# EAGLE design SBC_6522_ISA_YM2612_v1 (EAGLE 9.6.2)
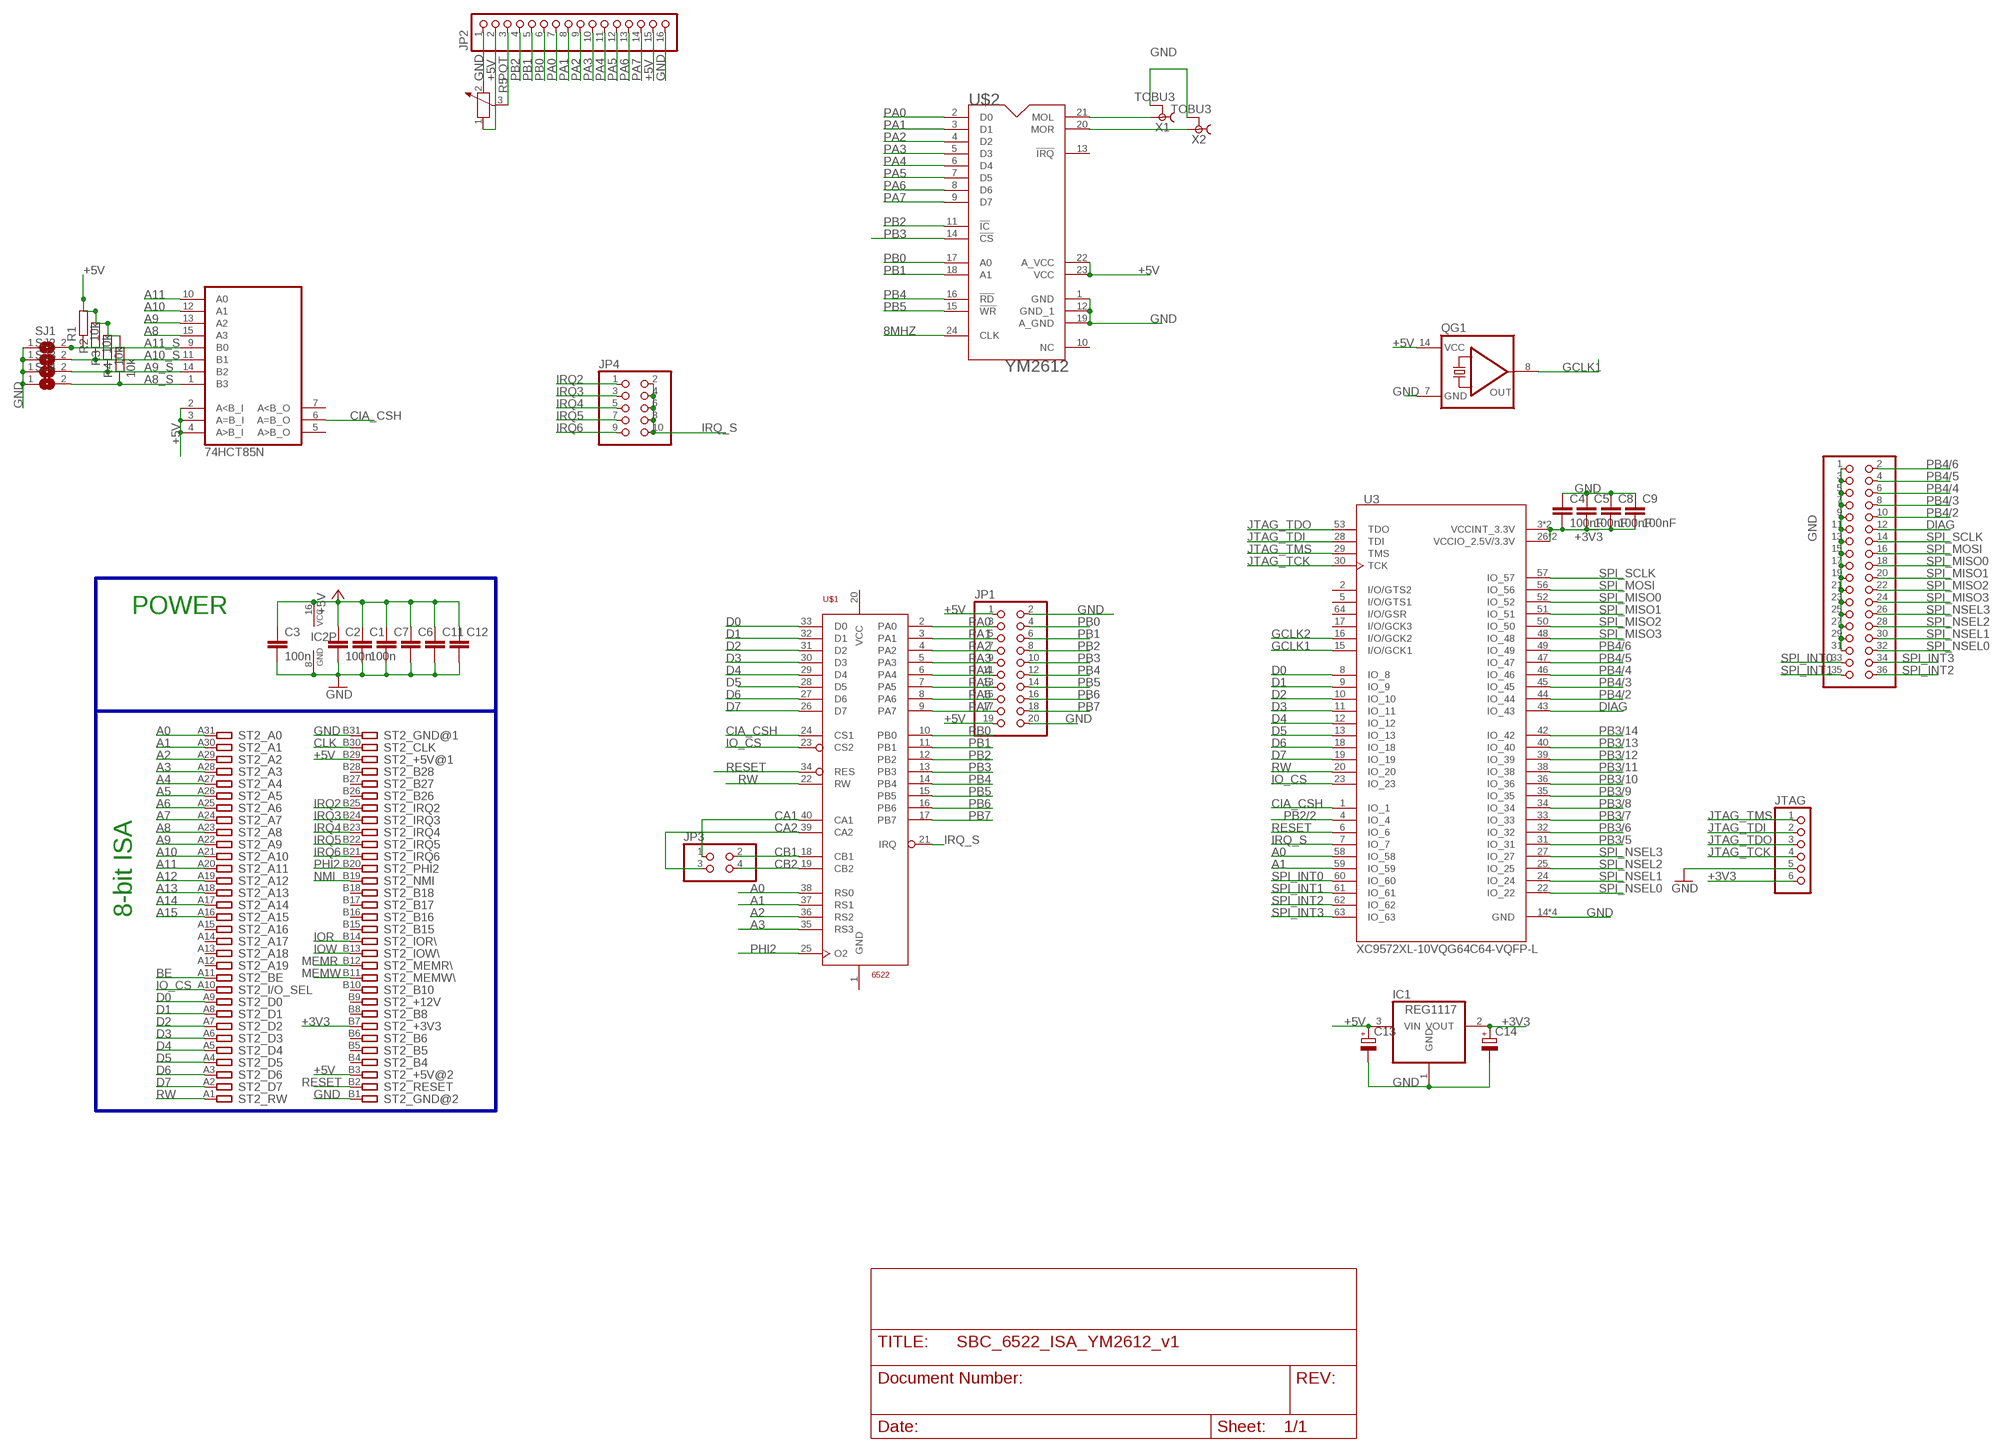
[diagram p0: schematic, sheet 1]

## Parts
C1  100n  C-EU050-025X075  [C050-025X075]
C2  100n  C-EU050-025X075  [C050-025X075]
C3  100n  C-EU050-025X075  [C050-025X075]
C4  100nF  CAPC603  [C603]
C5  100nF  CAPC603  [C603]
C6  C-EU050-035X075  [C050-035X075]
C7  C-EU050-035X075  [C050-035X075]
C8  100nF  CAPC603  [C603]
C9  100nF  CAPC603  [C603]
C11  C-EU050-035X075  [C050-035X075]
C12  C-EU050-035X075  [C050-035X075]
C13  CPOL-EUE2.5-5  [E2,5-5]
C14  CPOL-EUE2.5-5  [E2,5-5]
IC1  REG1117  [SOT223]
IC2  74HCT85N  [DIL16]
JP1  PINHD-2X10  [2X10]
JP2  PINHD-1X16  [1X16]
JP3  PINHD-2X2  [2X02]
JP4  PINHD-2X5  [2X05]
JP5  PINHD-2X18  [2X18]
JTAG  PINHD-1X6  [1X06]
QG1  QG5860  [DIL14S]
R1  10k  R-EU_0207/7  [0207/7]
R2  10k  R-EU_0207/7  [0207/7]
R3  10k  R-EU_0207/7  [0207/7]
R4  10k  R-EU_0207/7  [0207/7]
R5  POTENTIOMETER_PT-10  [PT-10]
SJ1  SJ  [SJ]
SJ2  SJ  [SJ]
SJ3  SJ  [SJ]
SJ4  SJ  [SJ]
ST2  IBM8BIT_ISASHORT  [APP_2X32_SHORT]
U3  XC9572XL-10VQG64C64-VQFP-L  [VQFP64]
U$1  6522  [6522]
U$2  YM2612  [DIL24]
X1  TOBU3  [TOBU3]
X2  TOBU3  [TOBU3]

## Nets
8MHZ: U$2.24(CLK)
+3V3: C4.2 C5.2 C8.2 C9.2 C14.+ IC1.2(VOUT) JTAG.6 ST2.B7 U3.3(VCCINT_3.3V) U3.26(VCCIO_2.5V/3.3V) U3.37(VCCINT_3.3V) U3.55(VCCIO_2.5V/3.3V)
+5V [power]: C1.1 C2.1 C3.1 C6.1 C7.1 C11.1 C12.1 C13.+ IC1.3(VIN) IC2.2(A<B_I) IC2.3(A=B_I) IC2.4(A>B_I) IC2.16(VCC) JP1.1 JP1.19 JP2.2 JP2.15 QG1.14(VCC) R1.2 R2.2 R3.2 R4.2 R5.1 ST2.B3 ST2.B29 U$2.22(A_VCC) U$2.23(VCC)
A0: ST2.A31 U3.58(IO_58) U$1.38(RS0)
A1: ST2.A30 U3.59(IO_59) U$1.37(RS1)
A2: ST2.A29 U$1.36(RS2)
A3: ST2.A28 U$1.35(RS3)
A4: ST2.A27
A5: ST2.A26
A6: ST2.A25
A7: ST2.A24
A8: IC2.15(A3) ST2.A23
A8_S: IC2.1(B3) R4.1 SJ4.2
A9: IC2.13(A2) ST2.A22
A9_S: IC2.14(B2) R3.1 SJ3.2
A10: IC2.12(A1) ST2.A21
A10_S: IC2.11(B1) R2.1 SJ2.2
A11: IC2.10(A0) ST2.A20
A11_S: IC2.9(B0) R1.1 SJ1.2
A12: ST2.A19
A13: ST2.A18
A14: ST2.A17
A15: ST2.A16
BE: ST2.A11
CA1: JP3.1 U$1.40(CA1)
CA2: JP3.3 U$1.39(CA2)
CB1: JP3.2 U$1.18(CB1)
CB2: JP3.4 U$1.19(CB2)
CIA_CSH: IC2.6(A=B_O) U3.1(IO_1) U$1.24(CS1)
CLK: ST2.B30
D0: ST2.A9 U3.8(IO_8) U$1.33(D0)
D1: ST2.A8 U3.9(IO_9) U$1.32(D1)
D2: ST2.A7 U3.10(IO_10) U$1.31(D2)
D3: ST2.A6 U3.11(IO_11) U$1.30(D3)
D4: ST2.A5 U3.12(IO_12) U$1.29(D4)
D5: ST2.A4 U3.13(IO_13) U$1.28(D5)
D6: ST2.A3 U3.18(IO_18) U$1.27(D6)
D7: ST2.A2 U3.19(IO_19) U$1.26(D7)
DIAG: JP5.12 U3.43(IO_43)
GCLK1: QG1.8(OUT) U3.15(I/O/GCK1)
GCLK2: U3.16(I/O/GCK2)
GND [power]: C1.2 C2.2 C3.2 C4.1 C5.1 C6.2 C7.2 C8.1 C9.1 C11.2 C12.2 C13.- C14.- IC1.1(GND) IC2.8(GND) JP1.2 JP1.20 JP2.1 JP2.16 JP5.1 JP5.3 JP5.5 JP5.7 JP5.9 JP5.11 JP5.13 JP5.15 JP5.17 JP5.19 JP5.21 JP5.23 JP5.25 JP5.27 JP5.29 JP5.31 JTAG.5 QG1.7(GND) R5.2 SJ1.1 SJ2.1 SJ3.1 SJ4.1 ST2.B1 ST2.B31 U3.14(GND) U3.21(GND) U3.41(GND) U3.54(GND) U$2.1(GND) U$2.12(GND_1) U$2.19(A_GND) X1.2 X1.2@1 X1.2@2 X2.2 X2.2@1 X2.2@2
IO_CS: ST2.A10 U3.23(IO_23) U$1.23(CS2)
IOR: ST2.B14
IOW: ST2.B13
IRQ2: JP4.1 ST2.B25
IRQ3: JP4.3 ST2.B24
IRQ4: JP4.5 ST2.B23
IRQ5: JP4.7 ST2.B22
IRQ6: JP4.9 ST2.B21
IRQ_S: JP4.2 JP4.4 JP4.6 JP4.8 JP4.10 U3.7(IO_7) U$1.21(IRQ)
JTAG_TCK: JTAG.4 U3.30(TCK)
JTAG_TDI: JTAG.2 U3.28(TDI)
JTAG_TDO: JTAG.3 U3.53(TDO)
JTAG_TMS: JTAG.1 U3.29(TMS)
MEMR: ST2.B12
MEMW: ST2.B11
N$20: U$2.21(MOL) X1.1
N$21: U$2.20(MOR) X2.1
NMI: ST2.B19
PA0: JP1.3 JP2.7 U$1.2(PA0) U$2.2(D0)
PA1: JP1.5 JP2.8 U$1.3(PA1) U$2.3(D1)
PA2: JP1.7 JP2.9 U$1.4(PA2) U$2.4(D2)
PA3: JP1.9 JP2.10 U$1.5(PA3) U$2.5(D3)
PA4: JP1.11 JP2.11 U$1.6(PA4) U$2.6(D4)
PA5: JP1.13 JP2.12 U$1.7(PA5) U$2.7(D5)
PA6: JP1.15 JP2.13 U$1.8(PA6) U$2.8(D6)
PA7: JP1.17 JP2.14 U$1.9(PA7) U$2.9(D7)
PB0: JP1.4 JP2.6 U$1.10(PB0) U$2.17(A0)
PB1: JP1.6 JP2.5 U$1.11(PB1) U$2.18(A1)
PB2: JP1.8 JP2.4 U$1.12(PB2) U$2.11(!IC)
PB2/2: U3.4(IO_4)
PB3: JP1.10 U$1.13(PB3) U$2.14(!CS)
PB3/5: U3.31(IO_31)
PB3/6: U3.32(IO_32)
PB3/7: U3.33(IO_33)
PB3/8: U3.34(IO_34)
PB3/9: U3.35(IO_35)
PB3/10: U3.36(IO_36)
PB3/11: U3.38(IO_38)
PB3/12: U3.39(IO_39)
PB3/13: U3.40(IO_40)
PB3/14: U3.42(IO_42)
PB4: JP1.12 U$1.14(PB4) U$2.16(!RD)
PB4/2: JP5.10 U3.44(IO_44)
PB4/3: JP5.8 U3.45(IO_45)
PB4/4: JP5.6 U3.46(IO_46)
PB4/5: JP5.4 U3.47(IO_47)
PB4/6: JP5.2 U3.49(IO_49)
PB5: JP1.14 U$1.15(PB5) U$2.15(!WR)
PB6: JP1.16 U$1.16(PB6)
PB7: JP1.18 U$1.17(PB7)
PHI2: ST2.B20 U$1.25(O2)
POT: JP2.3 R5.3
RESET: ST2.B2 U3.6(IO_6) U$1.34(RES)
RW: ST2.A1 U3.20(IO_20) U$1.22(RW)
SPI_INT0: JP5.33 U3.60(IO_60)
SPI_INT1: JP5.35 U3.61(IO_61)
SPI_INT2: JP5.36 U3.62(IO_62)
SPI_INT3: JP5.34 U3.63(IO_63)
SPI_MISO0: JP5.18 U3.52(IO_52)
SPI_MISO1: JP5.20 U3.51(IO_51)
SPI_MISO2: JP5.22 U3.50(IO_50)
SPI_MISO3: JP5.24 U3.48(IO_48)
SPI_MOSI: JP5.16 U3.56(IO_56)
SPI_NSEL0: JP5.32 U3.22(IO_22)
SPI_NSEL1: JP5.30 U3.24(IO_24)
SPI_NSEL2: JP5.28 U3.25(IO_25)
SPI_NSEL3: JP5.26 U3.27(IO_27)
SPI_SCLK: JP5.14 U3.57(IO_57)
Unconnected: IC2.5(A>B_O) IC2.7(A<B_O) ST2.A12 ST2.A13 ST2.A14 ST2.A15 ST2.B4 ST2.B5 ST2.B6 ST2.B8 ST2.B9 ST2.B10 ST2.B15 ST2.B16 ST2.B17 ST2.B18 ST2.B26 ST2.B27 ST2.B28 U3.2(I/O/GTS2) U3.5(I/O/GTS1) U3.17(I/O/GCK3) U3.64(I/O/GSR) U$1.1(GND) U$1.20(VCC) U$2.10(NC) U$2.13(!IRQ)

## Buses
A8,A9,A10,A11,ACIA_CS,IO_CS,IO_CS_N,N$3,N$4,N$8

## Notes on the sheet
- POWER
- 8-bit ISA

## Library data of the parts
C1-C3 = rcl:C-EU: CAPACITOR, European symbol
C4 C5 C8 C9 = dp_devices:CAP
C6 C7 C11 C12 = rcl:C-EU: CAPACITOR, European symbol; SPICEPREFIX: C
C13 C14 = rcl:CPOL-EU: POLARIZED CAPACITOR, European symbol; SPICEPREFIX: C
IC1 = burr-brown:REG1117: 800mA and 1A Low Dropout (LDO) Positive Regulator 1.8V, 2.5V, 2.85V, 3.3V, 5V, and Adj; MPN: REG1117; OC_FARNELL: 1097566; OC_NEWARK: 14P6981
IC2 = 74xx-eu:74*85: 4-bit magnitude COMPARATOR
JP1 = pinhead:PINHD-2X10: PIN HEADER
JP2 = pinhead:PINHD-1X16: PIN HEADER
JP3 = pinhead:PINHD-2X2: PIN HEADER
JP4 = pinhead:PINHD-2X5: PIN HEADER
JP5 = pinhead:PINHD-2X18: PIN HEADER
JTAG = pinhead:PINHD-1X6: PIN HEADER
QG1 = crystal:QG5860: CRYSTAL RESONATOR; OC_FARNELL: unknown; OC_NEWARK: unknown
R1-R4 = rcl:R-EU_: RESISTOR, European symbol; SPICEPREFIX: R
R5 = rcl:POTENTIOMETER_: Potentiometer; SPICEMODEL: POT; SPICEPREFIX: X
SJ1-SJ4 = jumper:SJ: SMD solder JUMPER
ST2 = TiRoRiN_Libs:IBM8BIT_ISA: 8-bit CARD IBM/PC-AT
U3 = CPLD:XC9572XL-10VQG64C: IC CPLD 72MC 10NS 64VQFP Manufacturer's datasheet <https://www.xilinx.com/support/documentation/data_sheets/ds057.pdf>; CREATED_BY: PCBLayout.com; DIGIKEY_PARTNO: 122-1388-ND; MANUFACTURER: Xilinx Inc; MPN: XC9572XL-10VQG64C; PACKAGE: VQFP-64
U$1 = TiRoRiN_Libs:6522
U$2 = TiRoRiN_Libs:YM2612
X1 X2 = con-hirschmann:TOBU3: Female Cinch CONNECTOR ( RCA Jack ); MF: FARNELL; MPN: TOBU 3; OC_FARNELL: 592791; OC_NEWARK: 06WX5914

## Net classes
0 default: width 0.152 mm, drill 0.2 mm, clearance 0.152 mm
1 power: width 0.254 mm, drill 0.66 mm, clearance 0.152 mm to class 0, clearance 0.152 mm
2 data: width 0.381 mm, drill 0.66 mm, clearance 0.254 mm to class 0, clearance 0.254 mm to class 1, clearance 0.254 mm

## Board
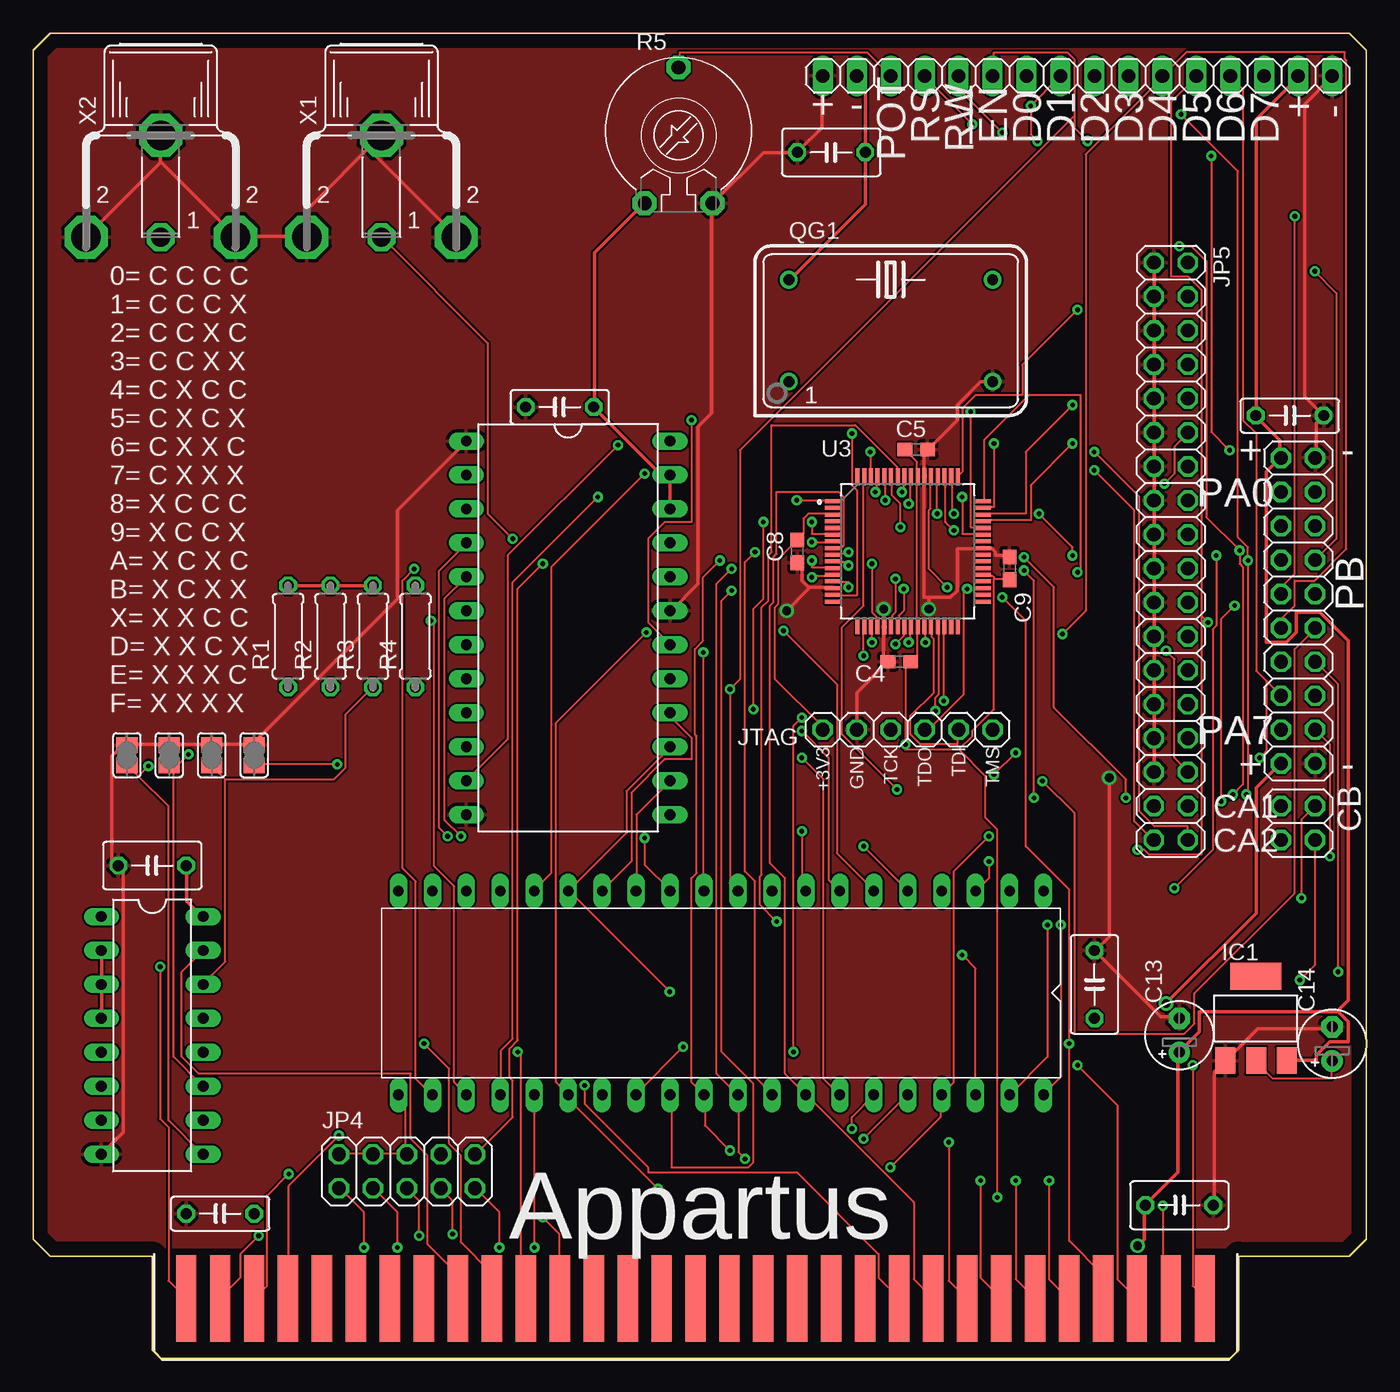
[diagram p1: board, top side]
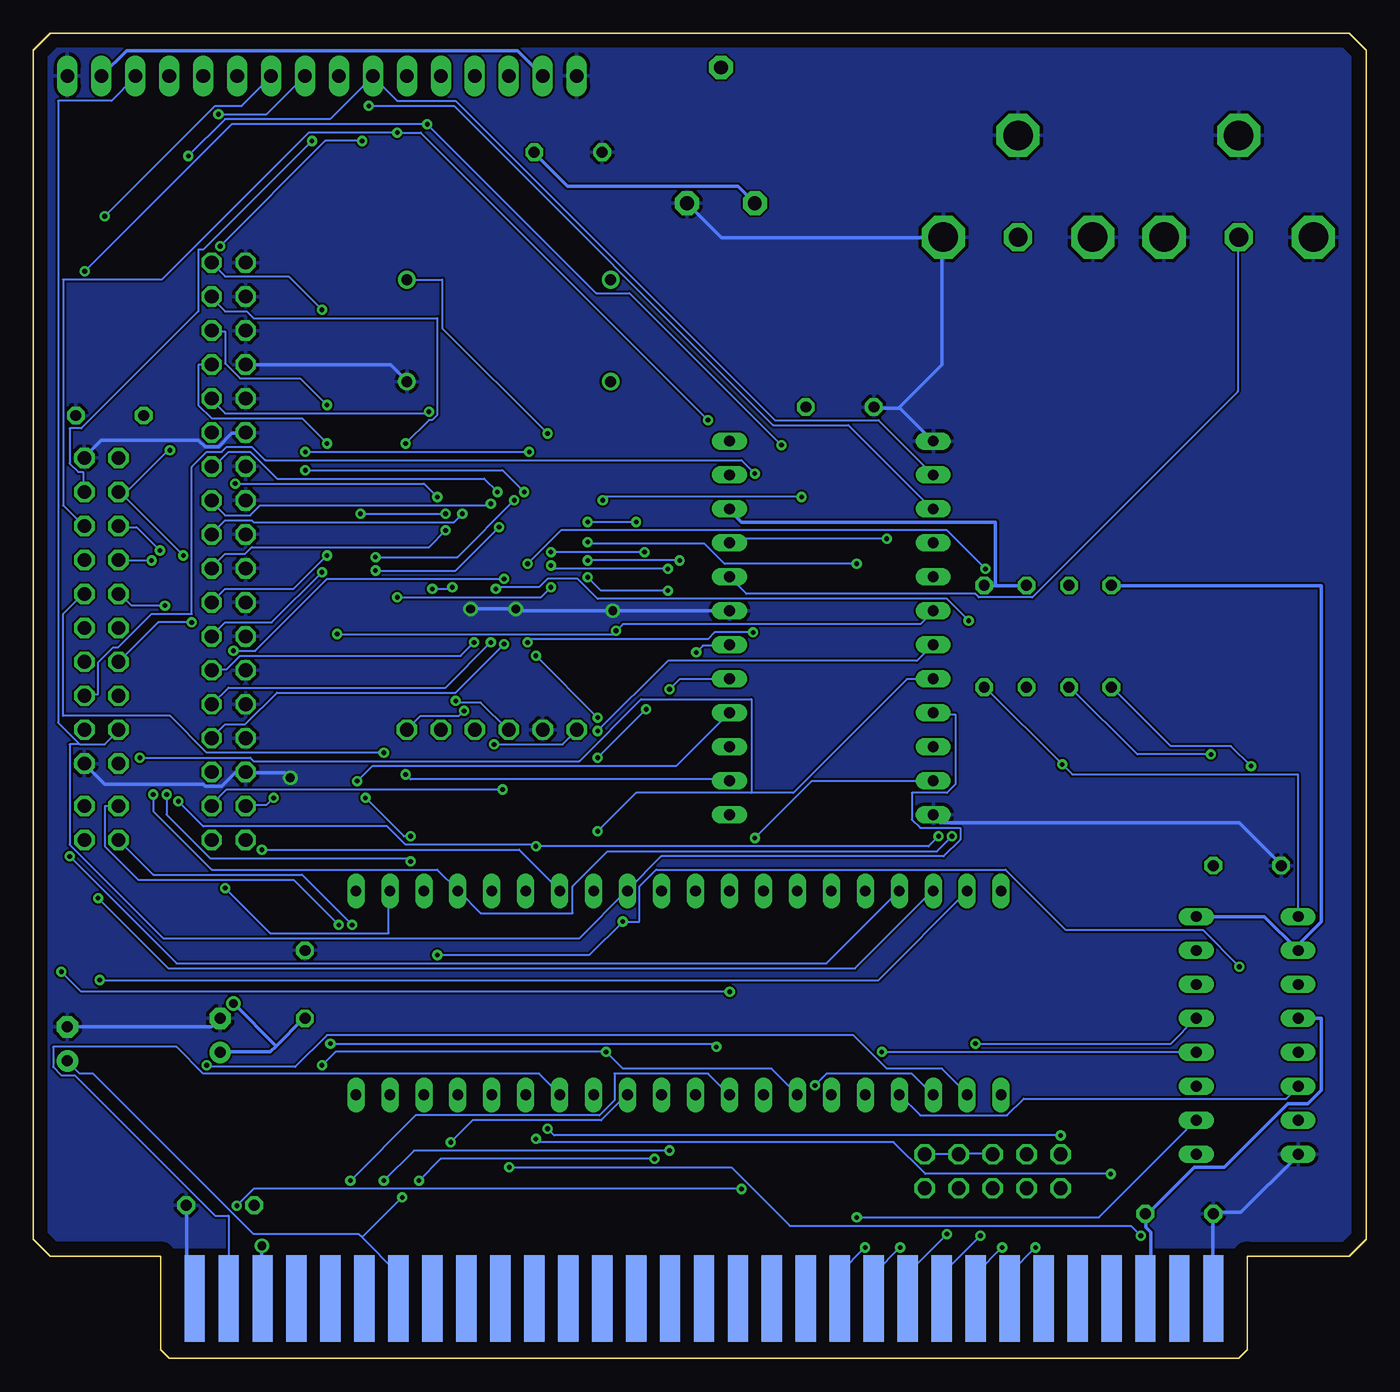
[diagram p2: board, bottom side, seen from below]

Size 99.7 x 99.06 mm. Coordinates in mm from the lower left corner, seen from the top.
Copper layers (1*16): Top 0.035mm / dielectric 1.5mm / Bottom 0.035mm
Design rules "appartus": minimum track width 6mil, minimum drill 0.35mm, track to track 6mil, track to pad 6mil, pad to pad 6mil, via to via 6mil, smd to smd 6mil, copper to edge 40mil, drill to drill 6mil, minimum pad ring 10mil, minimum via ring 8mil, stop-mask expansion 4mil, vias tented up to drill 0mil, thermal gap 10mil

### Footprints (pad centres in the part's own frame; a part is rotated, then mirrored left to right if it is on the bottom)
C050-025X075 = drill 0.813 octagon: 1 -2.54,0; 2 2.54,0
C603 = smd 1.1 x 1: 1 -0.85,0; 2 0.85,0
C050-035X075 = drill 0.813 octagon: 1 -2.54,0; 2 2.54,0
E2,5-5 = drill 0.813 pad 1.6: + -1.27,0 | drill 0.813 pad 1.6 octagon: - 1.27,0
SOT223 = smd 1.499 x 2.007: 1 -2.261,-3.15; 2 0.025,-3.15; 3 2.311,-3.15 | smd 3.81 x 2.007: 4 0,3.15
DIL16 = drill 0.813 long: 1 -8.89,-3.81; 2 -6.35,-3.81; 3 -3.81,-3.81; 4 -1.27,-3.81; 5 1.27,-3.81; 6 3.81,-3.81; 7 6.35,-3.81; 8 8.89,-3.81; 9 8.89,3.81; 10 6.35,3.81; 11 3.81,3.81; 12 1.27,3.81; 13 -1.27,3.81; 14 -3.81,3.81; 15 -6.35,3.81; 16 -8.89,3.81
2X10 = drill 1.016 octagon: 1 -11.43,-1.27; 2 -11.43,1.27; 3 -8.89,-1.27; 4 -8.89,1.27; 5 -6.35,-1.27; 6 -6.35,1.27; 7 -3.81,-1.27; 8 -3.81,1.27; 9 -1.27,-1.27; 10 -1.27,1.27; 11 1.27,-1.27; 12 1.27,1.27; 13 3.81,-1.27; 14 3.81,1.27; 15 6.35,-1.27; 16 6.35,1.27; 17 8.89,-1.27; 18 8.89,1.27; 19 11.43,-1.27; 20 11.43,1.27
1X16 = drill 1.016 long: 1 -19.05,0; 2 -16.51,0; 3 -13.97,0; 4 -11.43,0; 5 -8.89,0; 6 -6.35,0; 7 -3.81,0; 8 -1.27,0; 9 1.27,0; 10 3.81,0; 11 6.35,0; 12 8.89,0; 13 11.43,0; 14 13.97,0; 15 16.51,0; 16 19.05,0
2X02 = drill 1.016 octagon: 1 -1.27,-1.27; 2 -1.27,1.27; 3 1.27,-1.27; 4 1.27,1.27
2X05 = drill 1.016 octagon: 1 -5.08,-1.27; 2 -5.08,1.27; 3 -2.54,-1.27; 4 -2.54,1.27; 5 0,-1.27; 6 0,1.27; 7 2.54,-1.27; 8 2.54,1.27; 9 5.08,-1.27; 10 5.08,1.27
2X18 = drill 1.016 octagon: 1 -21.59,-1.27; 2 -21.59,1.27; 3 -19.05,-1.27; 4 -19.05,1.27; 5 -16.51,-1.27; 6 -16.51,1.27; 7 -13.97,-1.27; 8 -13.97,1.27; 9 -11.43,-1.27; 10 -11.43,1.27; 11 -8.89,-1.27; 12 -8.89,1.27; 13 -6.35,-1.27; 14 -6.35,1.27; 15 -3.81,-1.27; 16 -3.81,1.27; 17 -1.27,-1.27; 18 -1.27,1.27; 19 1.27,-1.27; 20 1.27,1.27; 21 3.81,-1.27; 22 3.81,1.27; 23 6.35,-1.27; 24 6.35,1.27; 25 8.89,-1.27; 26 8.89,1.27; 27 11.43,-1.27; 28 11.43,1.27; 29 13.97,-1.27; 30 13.97,1.27; 31 16.51,-1.27; 32 16.51,1.27; 33 19.05,-1.27; 34 19.05,1.27; 35 21.59,-1.27; 36 21.59,1.27
1X06 = drill 1.016 octagon: 1 -6.35,0; 2 -3.81,0; 3 -1.27,0; 4 1.27,0; 5 3.81,0; 6 6.35,0
DIL14S = drill 0.813: 1 -7.62,-3.81; 7 7.62,-3.81; 8 7.62,3.81; 14 -7.62,3.81
0207/7 = drill 0.813 octagon: 1 -3.81,0; 2 3.81,0
PT-10 = drill 1.016 pad 1.778 octagon: 1 -2.54,-5.08; 2 2.54,-5.08; 3 0,5.08
SJ = smd 1.168 x 1.6: 1 -0.762,0; 2 0.762,0
APP_2X32_SHORT = smd 1.524 x 6.477: A1 38.1,-44.45; A2 35.56,-44.45; A3 33.02,-44.45; A4 30.48,-44.45; A5 27.94,-44.45; A6 25.4,-44.45; A7 22.86,-44.45; A8 20.32,-44.45; A9 17.78,-44.45; A10 15.24,-44.45; A11 12.7,-44.45; A12 10.16,-44.45; A13 7.62,-44.45; A14 5.08,-44.45; A15 2.54,-44.45; A16 0,-44.45; A17 -2.54,-44.45; A18 -5.08,-44.45; A19 -7.62,-44.45; A20 -10.16,-44.45; A21 -12.7,-44.45; A22 -15.24,-44.45; A23 -17.78,-44.45; A24 -20.32,-44.45; A25 -22.86,-44.45; A26 -25.4,-44.45; A27 -27.94,-44.45; A28 -30.48,-44.45; A29 -33.02,-44.45; A30 -35.56,-44.45; A31 -38.1,-44.45 | smd 1.524 x 6.477 bottom: B1 38.1,-44.45; B2 35.56,-44.45; B3 33.02,-44.45; B4 30.48,-44.45; B5 27.94,-44.45; B6 25.4,-44.45; B7 22.86,-44.45; B8 20.32,-44.45; B9 17.78,-44.45; B10 15.24,-44.45; B11 12.7,-44.45; B12 10.16,-44.45; B13 7.62,-44.45; B14 5.08,-44.45; B15 2.54,-44.45; B16 0,-44.45; B17 -2.54,-44.45; B18 -5.08,-44.45; B19 -7.62,-44.45; B20 -10.16,-44.45; B21 -12.7,-44.45; B22 -15.24,-44.45; B23 -17.78,-44.45; B24 -20.32,-44.45; B25 -22.86,-44.45; B26 -25.4,-44.45; B27 -27.94,-44.45; B28 -30.48,-44.45; B29 -33.02,-44.45; B30 -35.56,-44.45; B31 -38.1,-44.45
VQFP64 = smd 1.17 x 0.3: 1 -5.62,3.75; 2 -5.62,3.25; 3 -5.62,2.75; 4 -5.62,2.25; 5 -5.62,1.75; 6 -5.62,1.25; 7 -5.62,0.75; 8 -5.62,0.25; 9 -5.62,-0.25; 10 -5.62,-0.75; 11 -5.62,-1.25; 12 -5.62,-1.75; 13 -5.62,-2.25; 14 -5.62,-2.75; 15 -5.62,-3.25; 16 -5.62,-3.75; 33 5.62,-3.75; 34 5.62,-3.25; 35 5.62,-2.75; 36 5.62,-2.25; 37 5.62,-1.75; 38 5.62,-1.25; 39 5.62,-0.75; 40 5.62,-0.25; 41 5.62,0.25; 42 5.62,0.75; 43 5.62,1.25; 44 5.62,1.75; 45 5.62,2.25; 46 5.62,2.75; 47 5.62,3.25; 48 5.62,3.75 | smd 0.3 x 1.17: 17 -3.75,-5.62; 18 -3.25,-5.62; 19 -2.75,-5.62; 20 -2.25,-5.62; 21 -1.75,-5.62; 22 -1.25,-5.62; 23 -0.75,-5.62; 24 -0.25,-5.62; 25 0.25,-5.62; 26 0.75,-5.62; 27 1.25,-5.62; 28 1.75,-5.62; 29 2.25,-5.62; 30 2.75,-5.62; 31 3.25,-5.62; 32 3.75,-5.62; 49 3.75,5.62; 50 3.25,5.62; 51 2.75,5.62; 52 2.25,5.62; 53 1.75,5.62; 54 1.25,5.62; 55 0.75,5.62; 56 0.25,5.62; 57 -0.25,5.62; 58 -0.75,5.62; 59 -1.25,5.62; 60 -1.75,5.62; 61 -2.25,5.62; 62 -2.75,5.62; 63 -3.25,5.62; 64 -3.75,5.62
6522 = drill 0.8 long: 1 -7.62,20.32; 2 -7.62,17.78; 3 -7.62,15.24; 4 -7.62,12.7; 5 -7.62,10.16; 6 -7.62,7.62; 7 -7.62,5.08; 8 -7.62,2.54; 9 -7.62,0; 10 -7.62,-2.54; 11 -7.62,-5.08; 12 -7.62,-7.62; 13 -7.62,-10.16; 14 -7.62,-12.7; 15 -7.62,-15.24; 16 -7.62,-17.78; 17 -7.62,-20.32; 18 -7.62,-22.86; 19 -7.62,-25.4; 20 -7.62,-27.94; 21 7.62,-27.94; 22 7.62,-25.4; 23 7.62,-22.86; 24 7.62,-20.32; 25 7.62,-17.78; 26 7.62,-15.24; 27 7.62,-12.7; 28 7.62,-10.16; 29 7.62,-7.62; 30 7.62,-5.08; 31 7.62,-2.54; 32 7.62,0; 33 7.62,2.54; 34 7.62,5.08; 35 7.62,7.62; 36 7.62,10.16; 37 7.62,12.7; 38 7.62,15.24; 39 7.62,17.78; 40 7.62,20.32
DIL24 = drill 0.813 long: 1 -13.97,-7.62; 2 -11.43,-7.62; 3 -8.89,-7.62; 4 -6.35,-7.62; 5 -3.81,-7.62; 6 -1.27,-7.62; 7 1.27,-7.62; 8 3.81,-7.62; 9 6.35,-7.62; 10 8.89,-7.62; 11 11.43,-7.62; 12 13.97,-7.62; 13 13.97,7.62; 14 11.43,7.62; 15 8.89,7.62; 16 6.35,7.62; 17 3.81,7.62; 18 1.27,7.62; 19 -1.27,7.62; 20 -3.81,7.62; 21 -6.35,7.62; 22 -8.89,7.62; 23 -11.43,7.62; 24 -13.97,7.62
TOBU3 = drill 1.397 octagon: 1 0,-2.54 | drill 2.21 octagon: 2 5.588,-2.54; 2@1 -5.588,-2.54; 2@2 0,5.08

### Placement (x,y rotation side)
C1  13.97,10.8 180 top
C2  39.37,71.12 180 top
C3  93.98,70.49 0 top
C4  64.77,52.07 0 top
C5  66.04,67.94 180 top
C6  8.89,36.83 180 top
C7  59.69,90.17 180 top
C8  57.15,60.33 90 top
C9  73.03,59.05 270 top
C11  85.73,11.43 0 top
C12  79.38,27.94 90 top
C13  85.73,24.13 90 top
C14  97.16,23.5 90 top
IC1  91.44,25.4 0 top
IC2  8.89,24.13 270 top
JP1  94.62,55.88 270 top
JP2  78.11,95.88 0 top
JP3  94.62,40.01 270 top
JP4  27.94,13.97 0 top
JP5  85.09,60.33 270 top
JTAG  65.41,46.99 180 top
QG1  64.14,76.84 0 top
R1  19.05,53.98 90 top
R2  22.23,53.98 90 top
R3  25.4,53.98 90 top
R4  28.58,53.98 90 top
R5  48.26,91.44 0 top
SJ1  6.99,45.09 270 top
SJ2  10.16,45.09 270 top
SJ3  13.34,45.09 270 top
SJ4  16.51,45.09 270 top
ST2  49.53,48.9 0 top
U3  65.41,60.33 0 top
U$1  55.25,27.31 270 top
U$2  40.01,54.61 270 top
X1  26.04,86.36 0 top
X2  9.53,86.36 0 top

### Tracks (layer width: path | path; a pad name or v marks a point on that pad's centre or on a via)
+3V3  (via drill 0.35)
  Top 0.152: U3.3 59.73,63.15 57.98,63.15 57.61,62.77 57.61,61.65 57.23,61.27 C8.2 57.11,61.15 55.73,59.77 55.73,56.4 55.48,56.15 55.48,50.77 58.98,47.27 58.98,47.02 JTAG.6 | C5.2 65.23,67.9 66.11,67.02 66.11,66.02 U3.55 66.11,65.9 66.11,54.77 U3.26 66.11,54.65 66.11,52.52 65.73,52.15 C4.2 65.61,52.02 65.23,51.65 v65.23,45.9 65.23,45.52 69.23,45.52 | 71.86,58.27 72.98,58.27 C9.2 | 71.86,58.27 71.86,58.4 71.73,58.52 71.11,58.52 U3.37 | 71.86,58.27 71.86,48.52 70.23,46.9 70.23,46.52 69.23,45.52 | IC1.2 91.48,22.15 92.73,20.9 97.11,20.9 97.11,22.15 C14.+ | 69.23,45.52 71.23,43.52 71.23,40.4 72.11,39.52 v72.11,12.02
  Bottom 0.152: v65.23,45.9 60.11,45.9 59.11,46.9 JTAG.6 | 75.11,9.02 72.48,6.4 72.48,4.52 ST2.B7 | 75.11,9.02 75.36,9.27 83.23,9.27 95.23,21.27 96.23,21.27 97.11,22.15 C14.+ | 75.11,9.02 v72.11,12.02
+5V  (via drill 0.66)
  Top 0.254: 97.61,25.9 98.36,25.15 98.36,23.65 96.98,23.65 95.98,22.65 95.98,22.27 93.86,22.27 IC1.3 | 97.61,25.9 87.23,25.9 87.23,24.4 85.73,22.9 C13.+ 85.61,22.77 85.61,13.9 83.23,11.52 C11.1 83.11,11.4 83.11,8.9 v82.61,8.4 | v84.73,26.52 91.48,33.27 91.48,42.65 93.23,44.4 JP1.19 | IC2.4 5.11,25.52 5.11,27.9 IC2.3 5.11,28.02 5.11,30.4 IC2.2 | IC2.16 12.61,33.02 11.48,34.15 11.48,36.77 C6.1 | JP2.15 94.61,95.77 91.48,92.65 91.48,70.52 C3.1 91.48,70.4 93.23,68.65 93.23,67.4 JP1.1 93.23,67.27 92.23,66.27 92.23,53.52 93.73,53.52 94.48,54.27 94.48,55.77 96.23,55.77 98.36,53.65 98.36,26.77 97.61,26.02 97.61,25.9 | QG1.14 56.61,80.65 62.23,86.27 C7.1 62.23,95.15 61.61,95.77 JP2.2 | R1.2 19.11,57.77 22.11,57.77 R2.2 22.23,57.77 25.36,57.77 R3.2 | U$2.22 47.61,63.52 47.61,66.02 U$2.23 47.48,65.52 41.98,71.02 C2.1 41.98,71.15 41.98,82.65 45.61,86.27 R5.1
  Bottom 0.254: 81.54,23.33 81.98,22.9 85.61,22.9 C13.+ | 81.54,23.33 79.48,25.4 C12.1 | 81.54,23.33 v84.73,26.52 | v82.61,8.4 82.61,4.52 ST2.B3 | ST2.B29 16.48,4.52 16.11,4.52 16.11,9.4 16.48,9.77 16.48,10.77 C1.1 16.36,10.77 12.86,14.27 10.61,14.27 5.86,19.02 4.36,19.02 3.36,20.02 3.36,25.4 4.98,25.4 IC2.4 | IC2.16 7.61,33.02 5.11,30.52 IC2.2 5.23,30.77 3.36,32.65 3.36,57.77 18.98,57.77 R1.2 | 27.73,57.77 28.48,57.77 R4.2 | 27.73,57.77 25.48,57.77 R3.2 | 27.73,57.77 27.73,62.52 46.73,62.52 47.61,63.4 U$2.22 | C7.1 62.23,90.15 59.73,87.65 46.98,87.65 45.73,86.4 R5.1 | JP2.15 92.73,97.77 63.48,97.77 JP2.2
A0  (via drill 0.35)
  Top 0.152: v55.61,32.65 54.36,33.9 54.36,36.02 54.48,36.15 54.48,56.15 54.98,56.65 54.98,60.02 55.23,60.27 55.23,69.77 61.48,69.77 64.61,66.65 64.61,66.02 U3.58 | v69.48,30.15 70.48,29.15 70.48,19.77 U$1.38 | ST2.A31 10.11,5.77 10.11,17.27 9.48,17.9 v9.48,29.27
  Bottom 0.152: v69.48,30.15 58.11,30.15 v55.61,32.65 54.36,32.65 54.36,35.27 53.11,36.52 26.98,36.52 22.48,32.02 12.23,32.02 v9.48,29.27
A1  (via drill 0.35)
  Top 0.152: v64.86,62.15 64.86,63.9 64.23,64.52 64.23,65.9 U3.59 | v74.11,58.9 74.86,58.15 v74.86,41.9 | v71.48,39.02 68.86,36.4 68.86,20.65 67.98,19.77 U$1.37 67.86,19.65 67.86,18.02 v64.11,14.27 | v16.86,9.15 15.48,7.77 15.48,6.02 13.98,4.52 ST2.A30
  Bottom 0.152: v64.86,62.15 68.11,58.9 v74.11,58.9 | v74.86,41.9 71.98,39.02 v71.48,39.02 | v16.86,9.15 17.61,9.9 43.11,9.9 47.48,14.27 v64.11,14.27
A2  (via drill 0.35)
  Top 0.152: v62.11,16.4 65.36,19.65 U$1.36 | v19.11,13.77 17.48,12.15 17.48,5.4 16.61,4.52 ST2.A29
  Bottom 0.152: v62.11,16.4 61.86,16.15 35.36,16.15 32.98,13.77 v19.11,13.77
A3  (via drill 0.35)
  Top 0.152: v61.23,17.15 61.23,18.02 62.86,19.65 U$1.35 | v22.86,16.65 19.11,12.9 19.11,4.52 ST2.A28
  Bottom 0.152: v61.23,17.15 60.73,16.65 v22.86,16.65
A8
  Top 0.152: IC2.15 12.61,30.4 11.11,28.9 11.11,22.52 12.36,21.27 28.23,21.27 28.23,16.4 29.48,15.15 29.48,8.52 31.73,6.27 31.73,4.52 ST2.A23
A8_S  (via drill 0.35)
  Top 0.152: v22.73,44.4 16.61,44.4 SJ4.2
  Bottom 0.152: R4.1 28.48,50.15 v22.73,44.4 21.98,43.65 5.11,43.65 5.11,33.02 IC2.1
A9  (via drill 0.35)
  Top 0.152: v29.23,23.52 31.11,21.65 31.11,16.02 31.98,15.15 31.98,8.65 34.23,6.4 34.23,4.52 ST2.A22
  Bottom 0.152: v29.23,23.52 14.61,23.52 12.73,25.4 IC2.13
A9_S
  Top 0.152: 14.36,43.27 13.36,44.27 SJ3.2 | 14.36,43.27 14.36,29.65 12.73,28.02 IC2.14 | 14.36,43.27 22.48,43.27 23.36,44.15 23.36,48.15 25.36,50.15 R3.1
A10  (via drill 0.35)
  Top 0.152: v36.23,22.9 36.48,22.65 36.48,4.77 36.73,4.52 ST2.A21
  Bottom 0.152: v36.23,22.9 12.73,22.9 IC2.12
A10_S  (via drill 0.35)
  Top 0.152: 10.48,44.02 10.23,44.27 SJ2.2 10.48,44.02 | 10.48,44.02 10.48,22.52 12.61,20.4 IC2.11 | 10.48,44.02 v11.61,45.15
  Bottom 0.152: v11.61,45.15 17.11,45.15 22.11,50.15 R2.1
A11  (via drill 0.35)
  Top 0.152: v38.11,10.52 39.36,9.27 39.36,4.52 ST2.A20
  Bottom 0.152: v38.11,10.52 19.98,10.52 12.73,17.77 IC2.10
A11_S  (via drill 0.35)
  Top 0.152: 7.86,43.52 10.11,41.27 10.11,17.77 12.61,15.27 IC2.9 | 7.86,43.52 7.11,44.27 SJ1.2 | 7.86,43.52 v8.61,44.27
  Bottom 0.152: v8.61,44.27 10.11,45.77 14.61,45.77 18.98,50.15 R1.1
CA1  (via drill 0.35)
  Top 0.152: v76.86,32.4 76.86,21.02 75.61,19.77 U$1.40
  Bottom 0.152: v76.86,32.4 80.23,35.77 91.86,35.77 94.36,38.27 94.36,41.27 JP3.1
CA2  (via drill 0.35)
  Top 0.152: v75.86,32.4 75.86,22.52 73.11,19.77 U$1.39
  Bottom 0.152: v75.86,32.4 79.61,36.15 90.73,36.15 93.23,38.65 JP3.3
CB1  (via drill 0.35)
  Top 0.152: v94.86,34.4 94.86,40.27 95.86,41.27 JP3.2
  Bottom 0.152: v94.86,34.4 89.61,29.15 38.23,29.15 32.48,34.9 U$1.18
CB2  (via drill 0.35)
  Top 0.152: v94.73,28.27 95.86,29.4 95.86,38.65 JP3.4
  Bottom 0.152: v94.73,28.27 36.48,28.27 29.86,34.9 U$1.19
CIA_CSH  (via drill 0.35)
  Top 0.152: v57.11,64.15 59.73,64.15 U3.1 | v42.23,64.4 35.86,58.02 35.86,23.9 34.98,23.02 34.98,19.77 U$1.24
  Bottom 0.152: v57.11,64.15 56.86,64.4 v42.23,64.4 | IC2.6 5.11,20.27 5.98,19.4 25.61,19.4 26.86,18.15 33.36,18.15 34.86,19.65 U$1.24
D0
  Top 0.152: U3.8 59.86,60.65 60.48,60.65 60.61,60.77 60.61,64.4 60.23,64.77 55.61,64.77 55.61,60.15 55.36,59.9 55.36,56.52 55.11,56.27 55.11,37.02 56.23,35.9 56.23,21.27 57.73,19.77 U$1.33 57.86,19.65 65.86,11.65 65.86,5.9 67.23,4.52 ST2.A9
D1  (via drill 0.35)
  Top 0.152: v60.98,60.27 60.98,60.15 59.86,60.15 U3.9 | v53.98,60.27 53.23,59.52 53.23,36.4 53.98,35.65 53.98,21.02 55.23,19.77 U$1.32 | v68.48,16.15 68.48,5.77 69.73,4.52 ST2.A8
  Bottom 0.152: v53.98,60.27 v60.98,60.27 | v68.48,16.15 66.86,17.77 57.23,17.77 55.36,19.65 U$1.32
D2  (via drill 0.35)
  Top 0.152: v60.98,59.27 60.98,59.52 59.86,59.52 U3.10 | v52.23,59.02 51.11,57.9 51.11,21.27 52.61,19.77 U$1.31 52.73,19.65 52.73,15.4 v53.23,14.9 | v70.86,13.27 70.86,6.02 72.36,4.52 ST2.A7
  Bottom 0.152: v60.98,59.27 60.73,59.02 v52.23,59.02 | v70.86,13.27 69.23,14.9 v53.23,14.9
D3  (via drill 0.35)
  Top 0.152: v58.23,59.65 58.23,59.15 59.73,59.15 U3.11 | v51.36,59.65 50.11,58.4 50.11,53.65 49.48,53.02 49.48,46.65 49.61,46.52 49.61,36.27 49.23,35.9 49.23,20.65 50.11,19.77 U$1.30 50.23,19.65 50.23,17.4 v52.11,15.52 | ST2.A6 73.48,5.9 v73.48,13.27
  Bottom 0.152: v51.36,59.65 v58.23,59.65 | v73.48,13.27 71.23,15.52 v52.11,15.52
D4  (via drill 0.35)
  Top 0.152: v58.23,58.4 58.23,58.52 59.73,58.52 U3.12 | v52.23,57.4 51.48,56.65 51.48,22.9 53.86,20.52 53.86,14.65 53.48,14.27 47.73,14.27 47.73,19.65 U$1.29 | v75.98,13.27 75.98,5.9 77.36,4.52 ST2.A5
  Bottom 0.152: v58.23,58.4 57.23,57.4 v52.23,57.4 | v75.98,13.27 71.11,18.15 57.36,18.15 56.23,19.27 56.23,21.27 49.23,21.27 47.73,19.77 U$1.29
D5  (via drill 0.35)
  Top 0.152: v60.98,57.65 60.98,58.02 59.86,58.02 U3.13 | v72.48,56.9 74.23,55.15 74.23,38.27 77.48,35.02 v77.48,23.52 77.48,8.77 79.98,6.27 79.98,4.52 ST2.A4 | v48.61,23.27 45.11,19.77 U$1.28
  Bottom 0.152: v60.98,57.65 61.73,56.9 v72.48,56.9 | v48.61,23.27 48.86,23.52 v77.48,23.52
D6  (via drill 0.35)
  Top 0.152: v62.11,52.52 62.11,54.65 U3.18 | v57.48,47.9 56.86,47.27 v56.86,22.9 | v78.11,21.9 81.11,18.9 81.11,5.9 82.48,4.52 ST2.A3
  Bottom 0.152: v57.48,47.9 v62.11,52.52 | U$1.27 42.61,19.77 44.48,21.65 55.61,21.65 v56.86,22.9 77.11,22.9 v78.11,21.9
D7  (via drill 0.35)
  Top 0.152: v62.73,53.52 62.73,54.65 U3.19 | v45.86,54.27 39.11,47.52 39.11,20.65 39.98,19.77 U$1.26 40.11,19.65 40.11,19.27 v46.73,12.65 | v84.48,11.4 84.48,5.02 84.98,4.52 ST2.A2
  Bottom 0.152: v62.73,53.52 62.48,53.77 49.23,53.77 48.73,54.27 v45.86,54.27 | v84.48,11.4 83.23,12.65 v46.73,12.65
DIAG  (via drill 0.35)
  Top 0.152: v69.48,64.4 69.48,61.65 70.98,61.65 U3.43 | v84.61,65.4 85.36,66.15 85.36,68.15 86.36,69.15 JP5.12
  Bottom 0.152: v69.48,64.4 70.48,65.4 v84.61,65.4
GCLK1  (via drill 0.35)
  Top 0.152: v61.23,69.15 61.23,65.27 61.61,64.9 61.61,57.02 59.86,57.02 U3.15
  Bottom 0.152: v61.23,69.15 69.11,77.02 69.11,80.65 QG1.8
GND  (via drill 0.66)
  Top 0.254: C13.- 85.61,25.52 84.36,25.52 79.48,30.4 C12.2 79.48,30.52 80.48,31.52 v80.48,43.4 | C14.- 97.11,24.65 91.61,24.65 89.23,22.27 IC1.1 89.11,22.15 88.36,21.4 88.36,11.52 C11.2 | JP1.2 95.98,67.4 95.98,69.9 96.48,70.4 C3.2 96.48,70.52 95.11,71.9 95.11,93.77 97.11,95.77 JP2.16 | JTAG.5 61.61,47.02 61.61,49.77 63.86,52.02 C4.1 63.86,52.15 63.61,52.4 63.61,54.65 U3.21 63.61,54.77 v63.61,56.02 | C8.1 57.48,59.15 57.48,58.15 57.98,57.65 | 57.98,57.65 59.73,57.65 U3.14 | v56.36,55.9 57.98,57.52 57.98,57.65 | JP5.31 83.86,43.9 83.86,46.27 JP5.29 83.86,46.4 83.86,48.77 JP5.27 83.86,48.9 83.86,51.4 JP5.25 83.86,51.52 83.86,53.9 JP5.23 83.86,54.02 83.86,56.4 JP5.21 83.86,56.52 83.86,59.02 JP5.19 83.86,59.15 83.86,61.52 JP5.17 83.86,61.65 83.86,64.02 JP5.15 83.86,64.15 83.86,66.65 JP5.13 83.86,66.77 83.86,69.15 JP5.11 83.86,69.27 83.86,71.65 JP5.9 83.86,71.77 83.86,74.27 JP5.7 83.86,74.4 83.86,76.77 JP5.5 83.86,76.9 83.86,79.27 JP5.3 83.86,79.4 83.86,81.9 JP5.1 | C9.1 72.98,60.02 71.98,60.02 71.98,60.27 71.73,60.52 71.11,60.52 U3.41 70.98,60.52 69.11,60.52 69.11,57.4 68.61,56.9 66.98,56.9 | QG1.7 71.73,73.02 70.86,73.02 69.11,71.27 69.11,70.15 66.98,68.02 C5.1 66.86,67.9 66.61,67.65 66.61,66.02 U3.54 66.61,65.9 66.61,56.9 66.98,56.9 | 66.98,56.9 v66.98,56.02 | IC2.8 5.11,15.27 6.73,16.9 6.73,36.4 6.36,36.77 C6.2 6.23,36.9 5.86,37.27 5.86,45.02 6.61,45.77 6.98,45.77 SJ1.1 7.11,45.9 10.11,45.9 SJ2.1 10.23,45.9 13.23,45.9 SJ3.1 13.36,45.9 16.48,45.9 SJ4.1 16.48,46.02 27.23,56.77 27.23,63.4 32.36,68.52 U$2.1 | 9.48,89.4 3.98,83.9 X2.2@1
  Top 0.254: 9.48,89.4 9.48,91.4 X2.2@2 | 9.48,89.4 9.61,89.4 15.11,83.9 X2.2 15.23,83.9 20.36,83.9 X1.2@1 20.36,84.02 20.36,85.77 25.98,91.4 X1.2@2 25.11,90.4 31.61,83.9 X1.2 | JP2.1 58.98,95.77 58.98,92.02 57.23,90.27 C7.2 57.11,90.15 54.61,90.15 50.86,86.4 R5.2 50.73,86.27 50.73,70.65 49.73,69.65 49.73,57.9 47.73,55.9 U$2.19
  Bottom 0.254: C11.2 88.23,11.4 88.23,4.52 87.73,4.52 ST2.B1 | C13.- 86.36,24.77 97.11,24.77 C14.- | U$2.19 47.73,55.9 v56.36,55.9 63.48,55.9 v63.61,56.02 v66.98,56.02 | JP1.20 95.86,44.4 94.36,42.9 86.98,42.9 86.86,42.77 85.61,42.77 84.61,43.77 83.86,43.77 JP5.31 83.73,43.77 80.86,43.77 v80.48,43.4 | QG1.7 71.86,73.15 72.98,74.27 83.73,74.27 JP5.7 | JP1.2 95.86,67.4 94.61,68.65 87.36,68.65 86.86,68.15 85.86,68.15 84.86,69.15 83.86,69.15 JP5.11 | IC2.8 5.11,15.15 9.36,10.9 11.36,10.9 C1.2 11.48,10.77 11.48,4.52 ST2.B31 | U$2.12 32.36,40.52 31.86,40.02 9.48,40.02 6.36,36.9 C6.2 | 34.86,71.02 32.48,68.65 U$2.1 | 34.86,71.02 36.73,71.02 C2.2 | 34.86,71.02 34.86,71.15 31.73,74.27 31.73,83.77 X1.2 31.86,83.77 48.23,83.77 50.73,86.27 R5.2
  pour Top: -4.44,102.24 104.14,102.24 104.14,8.26 -4.44,8.26
  pour Bottom: 104.14,102.24 -4.44,102.24 -4.44,8.26 104.14,8.26
IO_CS  (via drill 0.35)
  Top 0.152: v65.11,57.52 65.11,55.9 64.73,55.52 64.73,54.77 U3.23 | v29.73,55.15 29.98,54.9 29.98,36.77 31.48,35.27 31.48,20.65 32.36,19.77 U$1.23 | v41.23,20.4 41.23,19.02 45.98,14.27 45.98,13.9 57.11,13.9 63.23,7.77 63.23,6.02 64.73,4.52 ST2.A10
  Bottom 0.152: v65.11,57.52 64.98,57.65 61.86,57.65 61.23,58.27 58.98,58.27 57.48,56.77 31.36,56.77 v29.73,55.15 | v41.23,20.4 40.36,21.27 33.98,21.27 32.48,19.77 U$1.23
IRQ2  (via drill 0.35)
  Top 0.152: v24.73,8.27 24.73,10.9 22.98,12.65 JP4.1
  Bottom 0.152: v24.73,8.27 26.61,6.4 26.61,4.52 ST2.B25
IRQ3  (via drill 0.35)
  Top 0.152: v27.23,8.27 27.23,10.9 25.48,12.65 JP4.3
  Bottom 0.152: v27.23,8.27 29.11,6.4 29.11,4.52 ST2.B24
IRQ4  (via drill 0.35)
  Top 0.152: v28.86,9.15 28.86,11.77 27.98,12.65 JP4.5
  Bottom 0.152: v28.86,9.15 31.73,6.27 31.73,4.52 ST2.B23
IRQ5  (via drill 0.35)
  Top 0.152: v31.36,9.27 31.36,11.77 30.48,12.65 JP4.7
  Bottom 0.152: v31.36,9.27 34.23,6.4 34.23,4.52 ST2.B22
IRQ6  (via drill 0.35)
  Top 0.152: v34.86,8.27 34.86,10.9 33.11,12.65 JP4.9
  Bottom 0.152: v34.86,8.27 36.73,6.4 36.73,4.52 ST2.B21
IRQ_S  (via drill 0.35)
  Top 0.152: JP4.2 22.98,15.27 25.36,15.27 JP4.4 25.48,15.27 27.86,15.27 | 27.86,15.27 27.86,19.15 27.36,19.65 U$1.21 | 27.86,15.27 JP4.6 | v58.23,61.02 59.73,61.02 U3.7 | v38.11,59.4 36.23,57.52 36.23,23.77 35.61,23.15 35.61,21.02 35.86,20.77 35.86,18.02 33.11,15.27 JP4.10
  Bottom 0.152: 30.48,15.27 27.98,15.27 JP4.6 | v58.23,61.02 58.11,60.9 49.48,60.9 47.98,59.4 v38.11,59.4 | 30.48,15.27 32.98,15.27 JP4.10 | 30.48,15.27 JP4.8
JTAG_TCK  (via drill 0.35)
  Top 0.152: v68.11,49.15 68.11,54.65 U3.30
  Bottom 0.152: v68.11,49.15 67.98,49.02 66.23,49.02 64.23,47.02 JTAG.4
JTAG_TDI
  Top 0.152: U3.28 67.23,54.65 67.23,53.9 67.36,53.77 67.36,49.77 65.61,48.02 65.61,46.65 66.36,45.9 69.11,45.9 69.11,46.9 JTAG.2
JTAG_TDO  (via drill 0.35)
  Top 0.152: v68.36,57.65 66.98,59.02 66.98,63.4 67.11,63.52 67.11,65.9 U3.53 | v69.86,57.52 69.61,57.27 69.61,49.65 66.98,47.02 66.73,47.02 JTAG.3
  Bottom 0.152: v68.36,57.65 68.48,57.52 v69.86,57.52
JTAG_TMS  (via drill 0.35)
  Top 0.152: v67.48,48.4 67.48,49.4 67.73,49.65 67.73,54.65 U3.29
  Bottom 0.152: v67.48,48.4 67.86,48.02 70.73,48.02 71.73,47.02 JTAG.1
N$20  (via drill 0.35)
  Top 0.152: v35.86,61.27 33.98,63.15 33.98,75.9 26.11,83.77 X1.1
  Bottom 0.152: v35.86,61.27 47.36,61.27 47.61,61.02 U$2.21
N$21
  Bottom 0.152: U$2.20 47.61,58.4 46.36,57.15 29.23,57.15 28.98,56.9 24.98,56.9 9.61,72.27 9.61,83.77 X2.1
PA0  (via drill 0.35)
  Top 0.152: v85.36,35.15 88.23,38.02 88.23,54.52 88.48,54.77 v88.48,60.02 | v89.48,67.9 88.11,69.27 v88.11,89.9
  Bottom 0.152: v85.36,35.15 81.98,31.77 73.11,31.77 73.11,34.9 U$1.2 | 92.98,64.52 93.23,64.77 JP1.3 92.98,64.52 | 92.98,64.52 v88.48,60.02 | U$2.2 32.48,66.15 36.48,70.15 44.23,70.15 68.11,94.02 72.48,94.02 74.23,95.77 JP2.7 74.36,95.77 77.48,92.65 85.36,92.65 v88.11,89.9 | 92.98,64.52 89.61,67.9 v89.48,67.9
PA1  (via drill 0.35)
  Top 0.152: v71.48,37.15 71.48,35.9 70.61,35.02 U$1.3 | v89.73,42.15 90.48,42.9 90.48,59.15 90.23,59.4 v90.23,60.4 87.73,62.9 87.73,82.02 86.61,83.15 v85.73,83.15 | JP2.8 76.73,95.77 v74.61,93.65 74.61,91.52 v75.11,91.02
  Bottom 0.152: v71.48,37.15 71.73,37.4 86.48,37.4 89.73,40.65 v89.73,42.15 | v90.23,60.4 91.98,62.15 93.23,62.15 JP1.5 | v74.61,93.65 68.23,93.65 44.36,69.77 38.73,69.77 32.48,63.52 U$2.3 | v85.73,83.15 77.86,91.02 v75.11,91.02
PA2  (via drill 0.35)
  Top 0.152: v90.73,42.15 90.86,42.27 v90.86,59.65 90.86,60.65 90.11,61.4 90.11,88.77 v85.86,93.02 | v30.98,39.02 30.36,39.65 30.36,58.9 32.36,60.9 U$2.4
  Bottom 0.152: v90.73,42.15 90.73,40.9 86.36,36.52 69.48,36.52 67.98,35.02 U$1.4 67.86,34.9 66.23,33.27 59.36,33.27 59.36,35.27 56.73,37.9 32.11,37.9 v30.98,39.02 | v90.86,59.65 93.23,59.65 JP1.7 | v85.86,93.02 82.23,93.02 79.48,95.77 JP2.9
PA3  (via drill 0.35)
  Top 0.152: v94.36,85.4 94.36,58.65 93.36,57.65 93.36,57.27 JP1.9 | v62.11,38.27 65.36,35.02 U$1.5 | v31.98,39.02 30.73,40.27 30.73,56.77 32.36,58.4 U$2.5 | v89.86,56.27 88.86,55.27 v88.86,41.65
  Bottom 0.152: v94.36,85.4 86.11,93.65 84.11,93.65 81.98,95.77 JP2.10 | v31.98,39.02 32.73,38.27 v62.11,38.27 62.23,38.4 71.86,38.4 73.23,39.77 86.98,39.77 v88.86,41.65 | v89.86,56.27 92.36,56.27 93.23,57.15 JP1.9
PA4  (via drill 0.35)
  Top 0.152: v56.11,54.4 60.11,50.4 60.11,37.77 62.86,35.02 U$1.6 | JP1.11 93.36,54.65 93.36,55.27 94.36,56.27 94.36,58.15 95.86,58.15 98.23,60.52 98.23,97.02 98.11,97.15 98.11,97.65 86.23,97.65 84.48,95.9 JP2.11 84.36,95.77 84.36,95.65 78.73,90.02 78.73,55.9 v76.98,54.15
  Bottom 0.152: U$2.6 32.48,55.77 33.36,54.9 55.61,54.9 v56.11,54.4 56.36,54.15 v76.98,54.15
PA5  (via drill 0.35)
  Top 0.152: U$1.7 59.48,35.77 59.48,44.9 v57.48,46.9 | 87.36,55.52 v87.86,55.02 | 87.36,55.52 87.36,79.9 86.36,80.9 85.11,80.9 85.11,93.9 86.98,95.77 JP2.12 | v82.61,38.02 83.11,38.02 83.48,37.65 87.36,37.65 87.36,55.52
  Bottom 0.152: v57.48,46.9 52.23,52.15 33.61,52.15 32.48,53.27 U$2.7 | v87.86,55.02 90.36,55.02 93.23,52.15 JP1.13 | v82.61,38.02 63.36,38.02 60.36,35.02 U$1.7
PA6  (via drill 0.35)
  Top 0.152: v57.48,39.4 57.48,35.27 57.73,35.02 U$1.8 | 92.23,50.65 91.48,51.4 91.48,69.15 90.48,70.15 90.48,94.9 89.61,95.77 JP2.13 | 92.23,50.65 JP1.15 | v91.73,44.9 92.23,45.4 92.23,50.65
  Bottom 0.152: v57.48,39.4 54.61,42.27 45.98,42.27 | 45.98,42.27 42.86,42.27 34.36,50.77 32.48,50.77 U$2.8 | 45.98,42.27 45.98,49.27 54.23,49.27 58.86,44.65 83.23,44.65 83.48,44.9 v91.73,44.9
PA7
  Bottom 0.152: U$2.9 32.36,48.15 30.73,48.15 30.73,42.9 31.36,42.27 33.98,42.27 33.98,40.27 33.36,39.65 30.36,39.65 30.36,38.77 31.61,37.52 52.73,37.52 55.23,35.02 U$1.9 55.36,34.9 58.86,31.4 89.98,31.4 96.98,38.4 96.98,45.9 96.23,45.9 | 96.23,45.9 94.36,45.9 93.36,46.9 JP1.17 | 96.23,45.9 97.86,47.52 97.86,94.02 93.86,94.02 92.11,95.77 JP2.14
PB0  (via drill 0.35)
  Top 0.152: U$1.10 52.61,35.02 52.11,35.52 v52.11,50.02 52.86,50.77 52.86,67.9 77.86,92.9 | v78.86,91.02 77.86,92.02 77.86,92.9 | 77.86,92.9 77.86,97.15 77.36,97.65 71.86,97.65 71.86,95.9 JP2.6
  Bottom 0.152: v52.11,50.02 51.36,50.77 47.73,50.77 U$2.17 | v78.86,91.02 86.98,82.9 87.36,82.9 87.36,78.27 96.11,69.52 96.98,69.52 96.98,66.9 96.36,66.27 95.98,66.27 95.98,64.77 JP1.4
PB1  (via drill 0.35)
  Top 0.152: v50.11,52.77 50.11,35.02 U$1.11 | v72.48,91.65 69.23,94.9 69.23,95.77 JP2.5 | v49.23,70.15 49.23,62.52 47.23,62.52 45.98,61.27 45.98,55.02 47.61,53.4 U$2.18
  Bottom 0.152: v50.11,52.77 49.61,53.27 47.73,53.27 U$2.18 | JP1.6 95.98,62.27 97.48,63.77 97.48,80.65 90.11,80.65 79.11,91.65 v72.48,91.65 70.73,91.65 v49.23,70.15
PB2  (via drill 0.35)
  Top 0.152: v45.73,38.9 45.73,36.9 47.61,35.02 U$1.12 | v95.86,81.27 97.48,79.65 97.48,61.27 95.98,59.77 JP1.8 | v70.23,92.27 66.73,95.77 JP2.4 | v43.73,68.27 35.48,60.02 35.48,46.27 32.48,43.27 U$2.11
  Bottom 0.152: v45.73,38.9 41.48,43.15 32.48,43.15 U$2.11 | v95.86,81.27 84.86,92.27 v70.23,92.27 57.61,79.65 55.11,79.65 v43.73,68.27
PB3  (via drill 0.35)
  Top 0.152: U$1.13 45.11,35.02 45.11,40.65 47.61,43.15 U$2.14 | v71.86,43.65 v73.48,45.27
  Bottom 0.152: v73.48,45.27 86.73,45.27 89.48,48.02 97.48,48.02 97.48,55.65 95.98,57.15 JP1.10 | v71.86,43.65 71.48,43.27 47.73,43.27 U$2.14
PB4  (via drill 0.35)
  Top 0.152: U$1.14 42.61,35.02 44.73,37.15 44.73,42.27 47.23,44.77 49.23,44.77 49.23,46.4 47.73,47.9 47.73,48.15 U$2.16 | v75.48,43.15 77.86,40.77 77.86,24.27 86.11,24.27 86.86,25.02 86.86,27.27 94.36,34.77 94.36,53.02 95.86,54.52 JP1.12
  Bottom 0.152: v75.48,43.15 74.36,44.27 51.61,44.27 47.73,48.15 U$2.16
PB4/2  (via drill 0.35)
  Top 0.152: v70.11,70.77 70.11,62.15 70.98,62.15 U3.44
  Bottom 0.152: v70.11,70.77 70.23,70.65 85.36,70.65 86.36,71.65 JP5.10
PB4/3  (via drill 0.35)
  Top 0.152: v77.73,68.4 74.61,65.27 74.61,62.65 71.11,62.65 U3.45
  Bottom 0.152: v77.73,68.4 79.61,70.27 86.36,70.27 87.36,71.27 87.36,74.27 86.48,74.27 JP5.8
PB4/4  (via drill 0.35)
  Top 0.152: v77.73,71.27 74.23,67.77 74.23,63.15 71.11,63.15 U3.46
  Bottom 0.152: v77.73,71.27 79.73,73.27 84.23,73.27 85.36,74.4 85.36,76.77 86.36,76.77 JP5.6
PB4/5  (via drill 0.35)
  Top 0.152: v71.86,68.4 71.86,63.65 71.11,63.65 U3.47
  Bottom 0.152: v71.86,68.4 70.11,70.15 69.86,70.15 69.48,70.52 69.48,77.77 83.23,77.77 83.73,78.27 85.36,78.27 86.36,79.27 JP5.4
PB4/6  (via drill 0.35)
  Top 0.152: U3.49 69.48,66.27 69.48,71.02 70.48,72.02 73.98,72.02 73.98,74.27 v78.11,78.4
  Bottom 0.152: v78.11,78.4 80.61,80.9 85.36,80.9 86.36,81.9 JP5.2
PB5  (via drill 0.35)
  Top 0.152: U$2.15 47.61,45.65 44.36,42.4 44.36,39.27 40.11,35.02 U$1.15 40.11,34.9 v47.61,27.4 | v97.61,28.9 97.61,50.4 95.98,52.02 JP1.14
  Bottom 0.152: v97.61,28.9 96.11,27.4 v47.61,27.4
PB6  (via drill 0.35)
  Top 0.152: v45.73,66.15 38.73,59.15 38.73,36.27 37.48,35.02 U$1.16
  Bottom 0.152: v45.73,66.15 46.73,67.15 82.36,67.15 83.36,68.15 85.23,68.15 85.61,67.77 86.73,67.77 87.86,66.65 87.86,55.65 90.86,55.65 93.36,53.15 93.73,53.15 94.86,52.02 94.86,49.65 95.86,49.65 JP1.16
PB7  (via drill 0.35)
  Top 0.152: v96.98,37.52 96.98,45.9 JP1.18
  Bottom 0.152: v96.98,37.52 88.98,29.52 40.36,29.52 34.98,34.9 U$1.17
PHI2  (via drill 0.35)
  Top 0.152: v37.48,8.27 37.48,19.65 U$1.25
  Bottom 0.152: v37.48,8.27 39.36,6.4 39.36,4.52 ST2.B20
POT
  Top 0.152: JP2.3 64.11,95.9 62.36,97.65 48.36,97.65 48.36,96.52 R5.3
RESET  (via drill 0.35)
  Top 0.152: v58.23,62.52 58.23,61.65 59.73,61.65 U3.6 | v54.61,62.52 54.61,56.77 53.86,56.02 v53.86,48.52 | v57.48,44.9 59.11,43.27 59.11,20.9 60.23,19.77 U$1.34
  Bottom 0.152: v54.61,62.52 v58.23,62.52 | v57.48,44.9 v53.86,48.52 | ST2.B2 85.11,4.52 85.11,10.65 86.11,10.65 96.61,21.15 97.61,21.15 98.23,21.77 98.23,23.27 88.98,23.27 86.98,21.27 61.86,21.27 60.36,19.77 U$1.34
RW  (via drill 0.35)
  Top 0.152: v62.73,59.4 62.73,55.77 63.11,55.4 63.11,54.77 U3.20 | v28.48,59.02 27.61,58.15 27.61,36.65 28.61,35.65 28.61,20.9 29.73,19.77 U$1.22 | v86.73,21.9 86.73,5.4 87.61,4.52 ST2.A1
  Bottom 0.152: v62.73,59.4 60.23,61.9 31.36,61.9 v28.48,59.02 | v86.73,21.9 86.61,21.77 80.11,21.77 77.73,24.15 38.36,24.15 35.86,21.65 31.73,21.65 29.86,19.77 U$1.22
SPI_INT0  (via drill 0.35)
  Top 0.152: v63.73,64.15 63.73,65.9 U3.60 | v74.11,59.9 76.36,57.65 76.36,48.65 81.73,43.27 v81.73,41.9
  Bottom 0.152: v63.73,64.15 67.98,59.9 v74.11,59.9 | v81.73,41.9 82.23,41.4 83.73,41.4 JP5.33
SPI_INT1  (via drill 0.35)
  Top 0.152: v62.98,64.77 63.11,64.9 63.11,65.9 U3.61 | v79.36,66.4 82.36,63.4 82.36,40.15 83.73,38.77 JP5.35
  Bottom 0.152: v62.98,64.77 64.61,66.4 v79.36,66.4
SPI_INT2  (via drill 0.35)
  Top 0.152: v62.61,67.77 62.61,66.02 U3.62 | v79.36,67.77 82.73,64.4 82.73,40.9 83.86,39.77 86.36,39.77 86.36,38.77 JP5.36
  Bottom 0.152: v79.36,67.77 v62.61,67.77
SPI_INT3  (via drill 0.35)
  Top 0.152: v64.61,42.52 60.48,46.65 60.48,54.65 62.11,56.27 62.11,65.9 U3.63
  Bottom 0.152: v64.61,42.52 85.23,42.52 86.36,41.4 JP5.34
SPI_MISO0  (via drill 0.35)
  Top 0.152: v67.61,63.15 67.61,65.9 U3.52
  Bottom 0.152: v67.61,63.15 68.23,62.52 83.23,62.52 83.36,62.65 85.36,62.65 86.36,61.65 JP5.18
SPI_MISO1  (via drill 0.35)
  Top 0.152: v68.86,61.9 68.23,62.52 68.23,65.9 U3.51
  Bottom 0.152: v68.86,61.9 70.11,60.65 83.36,60.65 83.86,60.15 85.36,60.15 86.36,59.15 JP5.20
SPI_MISO2  (via drill 0.35)
  Top 0.152: v68.86,63.15 68.73,63.27 68.73,65.9 U3.50 | v75.23,63.15 77.73,60.65 v77.73,60.02
  Bottom 0.152: v75.23,63.15 v68.86,63.15 | v77.73,60.02 80.23,57.52 85.36,57.52 JP5.22
SPI_MISO3  (via drill 0.35)
  Top 0.152: v78.11,58.77 78.36,59.02 78.36,72.02 74.48,72.02 71.11,68.65 71.11,64.15 U3.48
  Bottom 0.152: v78.11,58.77 81.86,55.02 85.36,55.02 86.36,54.02 JP5.24
SPI_MOSI  (via drill 0.35)
  Top 0.152: v65.48,63.9 65.61,64.02 65.61,65.9 U3.56
  Bottom 0.152: v65.48,63.9 65.61,63.77 82.73,63.77 83.48,63.02 85.36,63.02 86.36,64.02 JP5.16
SPI_NSEL0  (via drill 0.35)
  Top 0.152: v64.48,58.27 64.48,55.77 64.23,55.52 64.23,54.77 U3.22 | v84.73,52.9 85.36,52.27 85.36,44.9 86.36,43.9 JP5.32
  Bottom 0.152: v64.48,58.27 77.73,58.27 83.11,52.9 v84.73,52.9
SPI_NSEL1  (via drill 0.35)
  Top 0.152: v64.48,53.4 65.11,54.02 65.11,54.65 U3.24
  Bottom 0.152: v64.48,53.4 68.11,49.77 81.48,49.77 83.86,47.4 85.36,47.4 86.36,46.4 JP5.30
SPI_NSEL2  (via drill 0.35)
  Top 0.152: v65.48,53.52 65.61,53.65 65.61,54.65 U3.25
  Bottom 0.152: v65.48,53.52 68.86,50.15 85.11,50.15 JP5.28
SPI_NSEL3  (via drill 0.35)
  Top 0.152: v66.73,53.52 66.73,54.65 U3.27
  Bottom 0.152: v66.73,53.52 67.73,52.52 84.23,52.52 85.23,51.52 86.36,51.52 JP5.26
SPI_SCLK  (via drill 0.35)
  Top 0.152: v64.98,64.77 65.11,64.9 65.11,65.9 U3.57
  Bottom 0.152: v64.98,64.77 65.98,65.77 81.48,65.77 83.48,67.77 85.11,67.77 86.11,66.77 86.36,66.77 JP5.14

### Text on the board
tNames: + | - | + | - | RS | !EN | D0 | D1 | D2 | D3 | D4 | D5 | D6 | D7 | RW | POT | + | - | PA0 | PB | 0= C C C C / 1= C C C X / 2= C C X C / 3= C C X X / 4= C X C C / 5= C X C X / 6= C X X C / 7= C X X X / 8= X C C C / 9= X C C X / A= X C X C / B= X C X X / X= X X C C / D= X X C X / E= X X X C / F= X X X X | PA7 | +3V3 | GND | TCK | TDO | TDI | TMS | + | - | CA1 | CB | CA2